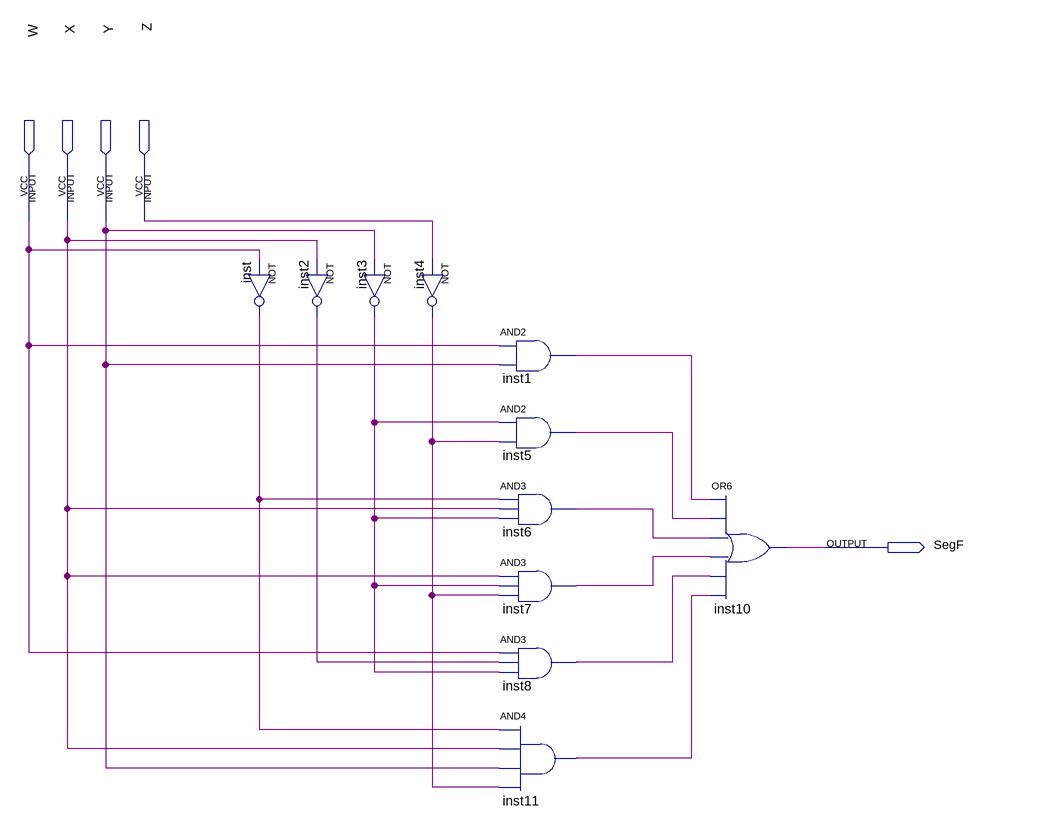
[diagram p0: schematic sheet]
// Quartus schematic SegF.bdf as structural Verilog: 11 symbols, 5 pins
module SegF (
  input  W,
  input  X,
  input  Y,
  input  Z,
  output SegF
);

  wire inst1_out, inst2_out, inst3_out, inst4_out, inst5_out, inst6_out, inst7_out, inst8_out, inst11_out,
       inst_out;

  not inst (inst_out, W);
  not inst2 (inst2_out, X);
  not inst3 (inst3_out, Y);
  not inst4 (inst4_out, Z);
  and inst1 (inst1_out, W, Y);
  and inst5 (inst5_out, inst3_out, inst4_out);
  and inst6 (inst6_out, inst_out, X, inst3_out);
  and inst7 (inst7_out, X, inst3_out, inst4_out);
  and inst8 (inst8_out, W, inst2_out, inst3_out);
  and inst11 (inst11_out, inst_out, X, Y, inst4_out);
  or inst10 (SegF, inst1_out, inst5_out, inst6_out, inst7_out, inst8_out, inst11_out);
endmodule
